# EAGLE schematic cs_v2 (EAGLE 9.6.1)

## Sheet 1 of 3
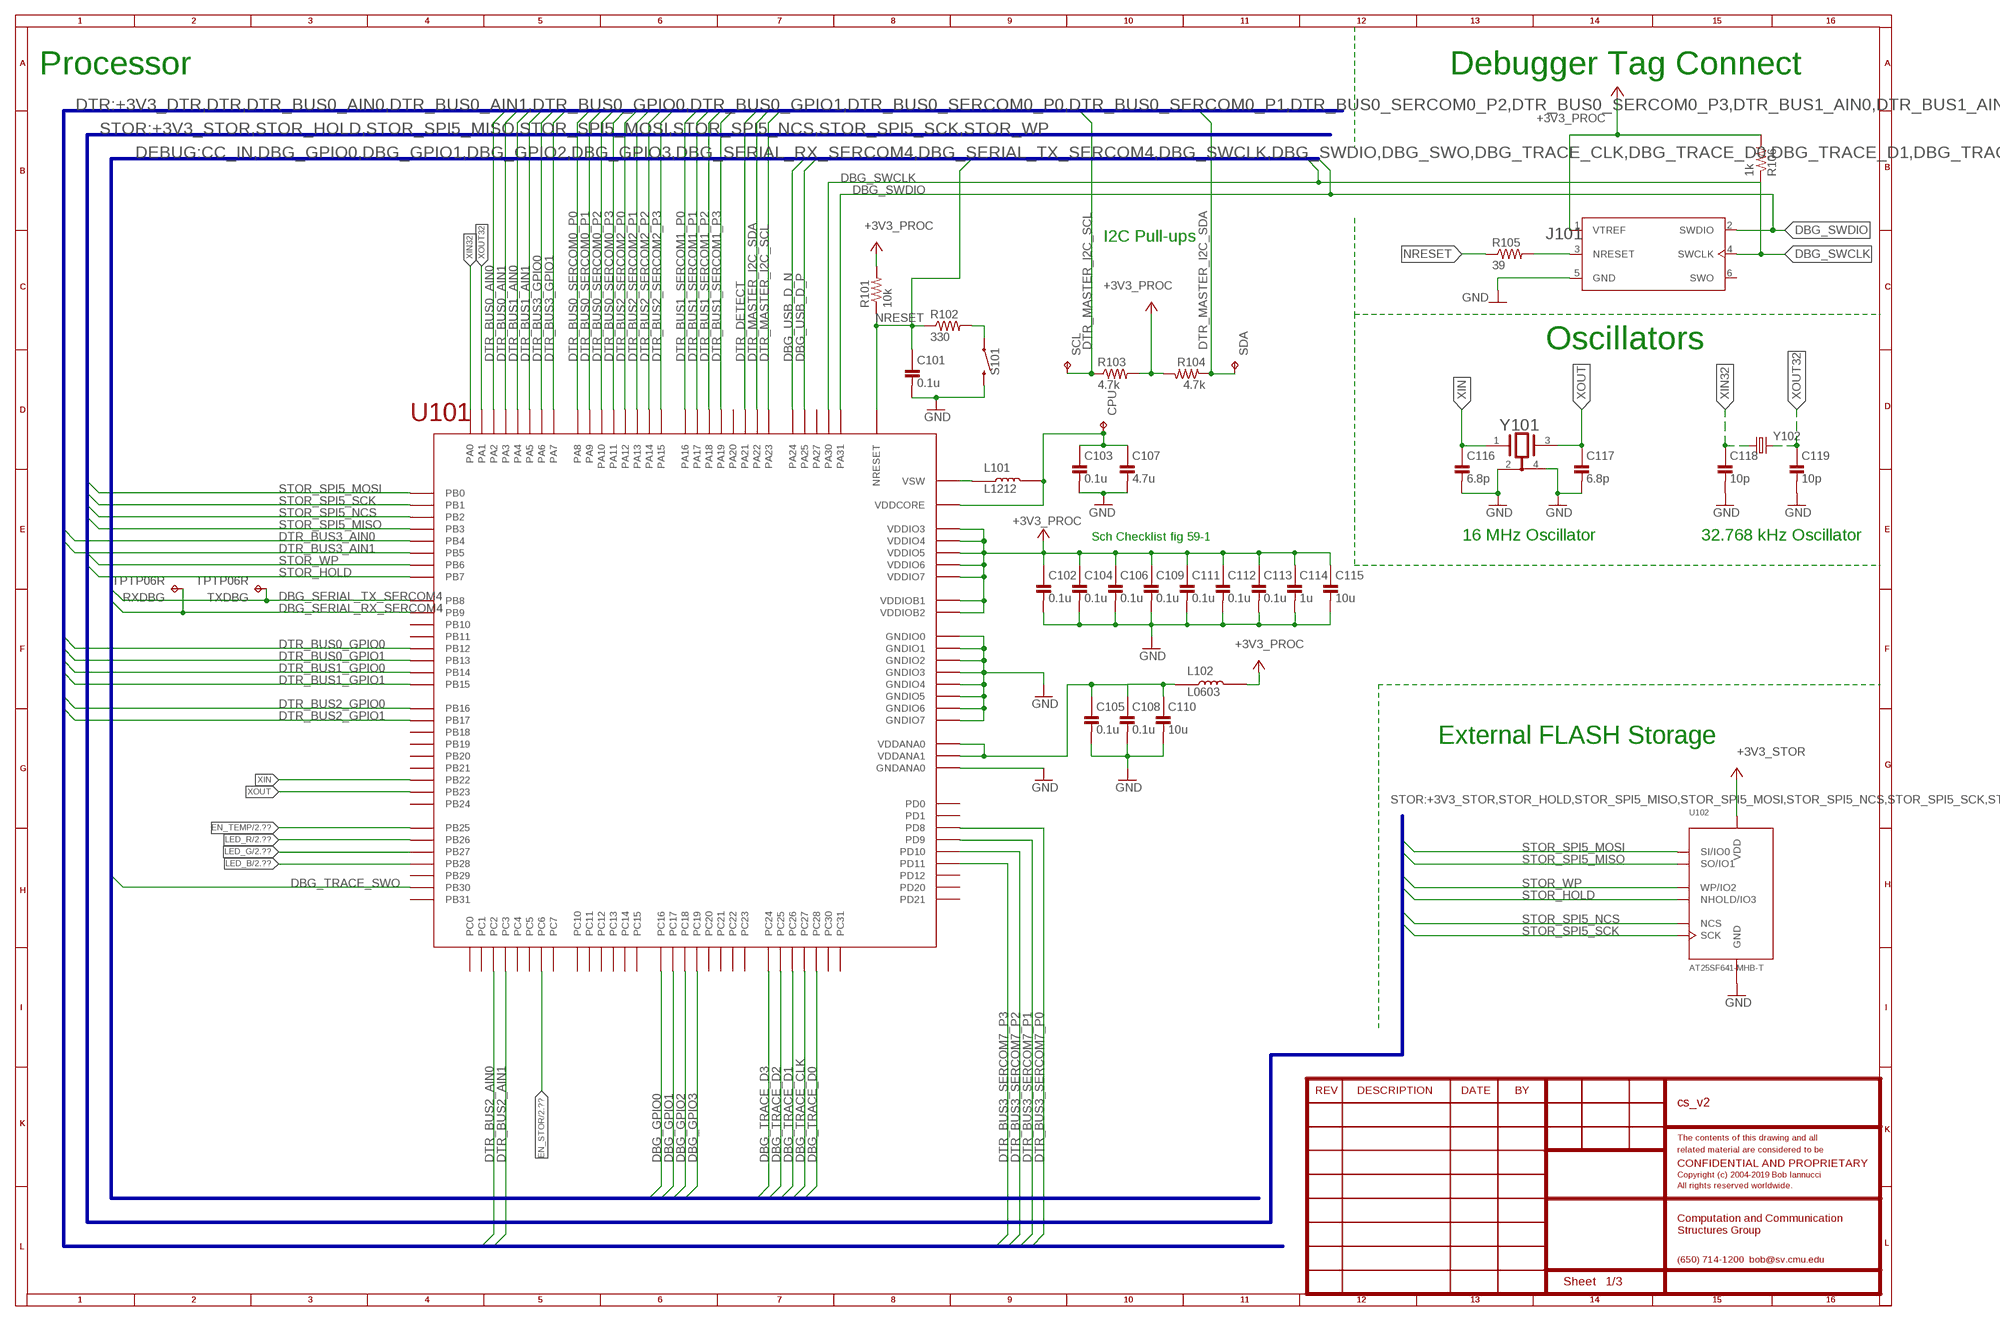
[diagram p0: schematic, sheet 1, part 1 of 2]
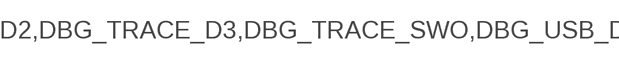
[diagram p1: schematic, sheet 1, part 2 of 2]

### Parts
C101  0.1u  C-0402  [C0402]
C102  0.1u  C-0402  [C0402]
C103  0.1u  C-0402  [C0402]
C104  0.1u  C-0402  [C0402]
C105  0.1u  C-0402  [C0402]
C106  0.1u  C-0402  [C0402]
C107  4.7u  C-0805  [C0805]
C108  0.1u  C-0402  [C0402]
C109  0.1u  C-0402  [C0402]
C110  10u  C-0805  [C0805]
C111  0.1u  C-0402  [C0402]
C112  0.1u  C-0402  [C0402]
C113  0.1u  C-0402  [C0402]
C114  1u  C-0402  [C0402]
C115  10u  C-0805  [C0805]
C116  6.8p  C-0402  [C0402]
C117  6.8p  C-0402  [C0402]
C118  10p  C-0402  [C0402]
C119  10p  C-0402  [C0402]
CPU  TPTP06R  [TP06R]
J101  J-JTAG-CORTEX-NEEDLE6-LEGS  [8.06.16_6-PIN_NEEDLE_ADAPTER_LEGS]
L101  L1212  [L1212]
L102  L0603  [L0603]
R101  10k  R-0402  [R0402]
R102  330  R-0402  [R0402]
R103  4.7k  R-0402  [R0402]
R104  4.7k  R-0402  [R0402]
R105  39  R-0402  [R0402]
R106  1k  R-0402  [R0402]
RXDBG  TPTP06R  [TP06R]
S101  SW_EVQ-P7L01P_SPST_RA  [SW_EVQ-P7L01P]
SCL  TPTP06R  [TP06R]
SDA  TPTP06R  [TP06R]
TXDBG  TPTP06R  [TP06R]
U101  ATSAMD51  [TFBGA120]
U102  AT25SF641-MHB-T  [8-UDFN]
Y101  16M  EPSON_TSX-3225_16.0000MF09Z-AC3  [XTAL_EPSON_TSX3225]
Y102  ABS07-32.768KHZ-9-T  [XTAL320X150X90]

### Nets
+3V3_PROC: C102.1 C104.1 C106.1 C109.1 C111.1 C112.1 C113.1 C114.1 C115.1 J101.1(VTREF) L102.2 R101.2 R103.2 R104.2 R106.2 U101.VDDIO3 U101.VDDIO4 U101.VDDIO5 U101.VDDIO6 U101.VDDIO7 U101.VDDIOB1 U101.VDDIOB2 ; supply symbol labelled +3V3 ; also sheet 2,3
+3V3_STOR [power_3v3]: U102.8(VDD) ; supply symbol labelled +3V3 ; also sheet 2
DBG_GPIO0: U101.PC16 ; also sheet 3
DBG_GPIO1: U101.PC17 ; also sheet 3
DBG_GPIO2: U101.PC18 ; also sheet 3
DBG_GPIO3: U101.PC19 ; also sheet 3
DBG_SERIAL_RX_SERCOM4: RXDBG.TP U101.PB09(PB9) ; also sheet 3
DBG_SERIAL_TX_SERCOM4: TXDBG.TP U101.PB08(PB8) ; also sheet 3
DBG_SWCLK: J101.4(SWCLK) R106.1 U101.PA30 ; also sheet 3
DBG_SWDIO: J101.2(SWDIO) U101.PA31 ; also sheet 3
DBG_TRACE_CLK: U101.PC27 ; also sheet 3
DBG_TRACE_D0: U101.PC28 ; also sheet 3
DBG_TRACE_D1: U101.PC26 ; also sheet 3
DBG_TRACE_D2: U101.PC25 ; also sheet 3
DBG_TRACE_D3: U101.PC24 ; also sheet 3
DBG_TRACE_SWO: U101.PB30 ; also sheet 3
DBG_USB_D_N [differential]: U101.PA24 ; also sheet 3
DBG_USB_D_P [differential]: U101.PA25 ; also sheet 3
DTR_BUS0_AIN0: U101.PA02(PA2) ; also sheet 3
DTR_BUS0_AIN1: U101.PA03(PA3) ; also sheet 3
DTR_BUS0_GPIO0: U101.PB12 ; also sheet 3
DTR_BUS0_GPIO1: U101.PB13 ; also sheet 3
DTR_BUS0_SERCOM0_P0: U101.PA08(PA8) ; also sheet 3
DTR_BUS0_SERCOM0_P1: U101.PA09(PA9) ; also sheet 3
DTR_BUS0_SERCOM0_P2: U101.PA10 ; also sheet 3
DTR_BUS0_SERCOM0_P3: U101.PA11 ; also sheet 3
DTR_BUS1_AIN0: U101.PA04(PA4) ; also sheet 3
DTR_BUS1_AIN1: U101.PA05(PA5) ; also sheet 3
DTR_BUS1_GPIO0: U101.PB14 ; also sheet 3
DTR_BUS1_GPIO1: U101.PB15 ; also sheet 3
DTR_BUS1_SERCOM1_P0: U101.PA16 ; also sheet 3
DTR_BUS1_SERCOM1_P1: U101.PA17 ; also sheet 3
DTR_BUS1_SERCOM1_P2: U101.PA18 ; also sheet 3
DTR_BUS1_SERCOM1_P3: U101.PA19 ; also sheet 3
DTR_BUS2_AIN0: U101.PC02(PC2) ; also sheet 3
DTR_BUS2_AIN1: U101.PC03(PC3) ; also sheet 3
DTR_BUS2_GPIO0: U101.PB16 ; also sheet 3
DTR_BUS2_GPIO1: U101.PB17 ; also sheet 3
DTR_BUS2_SERCOM2_P0: U101.PA12 ; also sheet 3
DTR_BUS2_SERCOM2_P1: U101.PA13 ; also sheet 3
DTR_BUS2_SERCOM2_P2: U101.PA14 ; also sheet 3
DTR_BUS2_SERCOM2_P3: U101.PA15 ; also sheet 3
DTR_BUS3_AIN0: U101.PB04(PB4) ; also sheet 3
DTR_BUS3_AIN1: U101.PB05(PB5) ; also sheet 3
DTR_BUS3_GPIO0: U101.PA06(PA6) ; also sheet 3
DTR_BUS3_GPIO1: U101.PA07(PA7) ; also sheet 3
DTR_BUS3_SERCOM7_P0: U101.PD08(PD8) ; also sheet 3
DTR_BUS3_SERCOM7_P1: U101.PD09(PD9) ; also sheet 3
DTR_BUS3_SERCOM7_P2: U101.PD10 ; also sheet 3
DTR_BUS3_SERCOM7_P3: U101.PD11 ; also sheet 3
DTR_DETECT: U101.PA21 ; also sheet 3
DTR_MASTER_I2C_SCL: R103.1 SCL.TP U101.PA23 ; also sheet 2,3
DTR_MASTER_I2C_SDA: R104.1 SDA.TP U101.PA22 ; also sheet 2,3
EN_STOR: U101.PC06(PC6) ; also sheet 2
EN_TEMP: U101.PB25 ; also sheet 2
GND: C101.2 C102.2 C103.2 C104.2 C105.2 C106.2 C107.2 C108.2 C109.2 C110.2 C111.2 C112.2 C113.2 C114.2 C115.2 C116.2 C117.2 C118.2 C119.2 J101.5(GND) S101.2_1 S101.2_2 U101.GNDANA0 U101.GNDIO0 U101.GNDIO1 U101.GNDIO2 U101.GNDIO3 U101.GNDIO4 U101.GNDIO5 U101.GNDIO6 U101.GNDIO7 U102.4(GND) U102.9(GND) Y101.2(1_GND) Y101.4(2_GND) ; also sheet 2,3
JTAG_NRESET: J101.3(NRESET) R105.2
LED_B: U101.PB28 ; also sheet 2
LED_G: U101.PB27 ; also sheet 2
LED_R: U101.PB26 ; also sheet 2
N$5: R102.2 S101.1_1 S101.1_2
NRESET: C101.1 R101.1 R102.1 R105.1 U101.NRESET ; also sheet 3
STOR_HOLD: U101.PB07(PB7) U102.7(NHOLD/IO3)
STOR_SPI5_MISO: U101.PB03(PB3) U102.2(SO/IO1)
STOR_SPI5_MOSI: U101.PB00(PB0) U102.5(SI/IO0)
STOR_SPI5_NCS: U101.PB02(PB2) U102.1(NCS)
STOR_SPI5_SCK: U101.PB01(PB1) U102.6(SCK)
STOR_WP: U101.PB06(PB6) U102.3(WP/IO2)
VDDANA: C105.1 C108.1 C110.1 L102.1 U101.VDDANA0 U101.VDDANA1
VDDCORE: C103.1 C107.1 CPU.TP L101.P$2 U101.VDDCORE
VSW: L101.P$1 U101.VSW
XIN: C116.1 U101.PB22 Y101.1
XIN32: C118.1 U101.PA00(PA0) Y102.1
XOUT: C117.1 U101.PB23 Y101.3
XOUT32: C119.1 U101.PA01(PA1) Y102.2
Unconnected: J101.6(SWO) U101.PA20 U101.PA27 U101.PB10 U101.PB11 U101.PB18 U101.PB19 U101.PB20 U101.PB21 U101.PB24 U101.PB29 U101.PB31 U101.PC00(PC0) U101.PC01(PC1) U101.PC04(PC4) U101.PC05(PC5) U101.PC07(PC7) U101.PC10 U101.PC11 U101.PC12 U101.PC13 U101.PC14 U101.PC15 U101.PC20 U101.PC21 U101.PC22 U101.PC23 U101.PC30 U101.PC31 U101.PD00(PD0) U101.PD01(PD1) U101.PD12 U101.PD20 U101.PD21

### Buses
STOR:+3V3_STOR,STOR_HOLD,STOR_SPI5_MISO,STOR_SPI5_MOSI,STOR_SPI5_NCS,STOR_SPI5_SCK,STOR_WP
DTR:+3V3_DTR,DTR,DTR_BUS0_AIN0,DTR_BUS0_AIN1,DTR_BUS0_GPIO0,DTR_BUS0_GPIO1,DTR_BUS0_SERCOM0_P0,DTR_BUS0_SERCOM0_P1,DTR_BUS0_SERCOM0_P2,DTR_BUS0_SERCOM0_P3,DTR_BUS1_AIN0,DTR_BUS1_AIN1,DTR_BUS1_GPIO0,DTR_BUS1_GPIO1,DTR_BUS1_SERCOM1_P0,DTR_BUS1_SERCOM1_P1,DTR_BUS1_SERCOM1_P2,DTR_BUS1_SERCOM1_P3,DTR_BUS2_AIN0,DTR_BUS2_AIN1,DTR_BUS2_GPIO0,DTR_BUS2_GPIO1,DTR_BUS2_SERCOM2_P0,DTR_BUS2_SERCOM2_P1,DTR_BUS2_SERCOM2_P2,DTR_BUS2_SERCOM2_P3,DTR_BUS3_AIN0,DTR_BUS3_AIN1,DTR_BUS3_GPIO0,DTR_BUS3_GPIO1,DTR_BUS3_SERCOM7_P0,DTR_BUS3_SERCOM7_P1,DTR_BUS3_SERCOM7_P2,DTR_BUS3_SERCOM7_P3,DTR_DETECT,DTR_MASTER_I2C_SCL,DTR_MASTER_I2C_SDA
DEBUG:CC_IN,DBG_GPIO0,DBG_GPIO1,DBG_GPIO2,DBG_GPIO3,DBG_SERIAL_RX_SERCOM4,DBG_SERIAL_TX_SERCOM4,DBG_SWCLK,DBG_SWDIO,DBG_SWO,DBG_TRACE_CLK,DBG_TRACE_D0,DBG_TRACE_D1,DBG_TRACE_D2,DBG_TRACE_D3,DBG_TRACE_SWO,DBG_USB_D-,DBG_USB_D+,NRESET,VDD_DBG

### Notes on the sheet
- Processor | Debugger Tag Connect
- I2C Pull-ups
- Oscillators
- Sch Checklist fig 59-1 | 16 MHz Oscillator | 32.768 kHz Oscillator
- External FLASH Storage

## Sheet 2 of 3
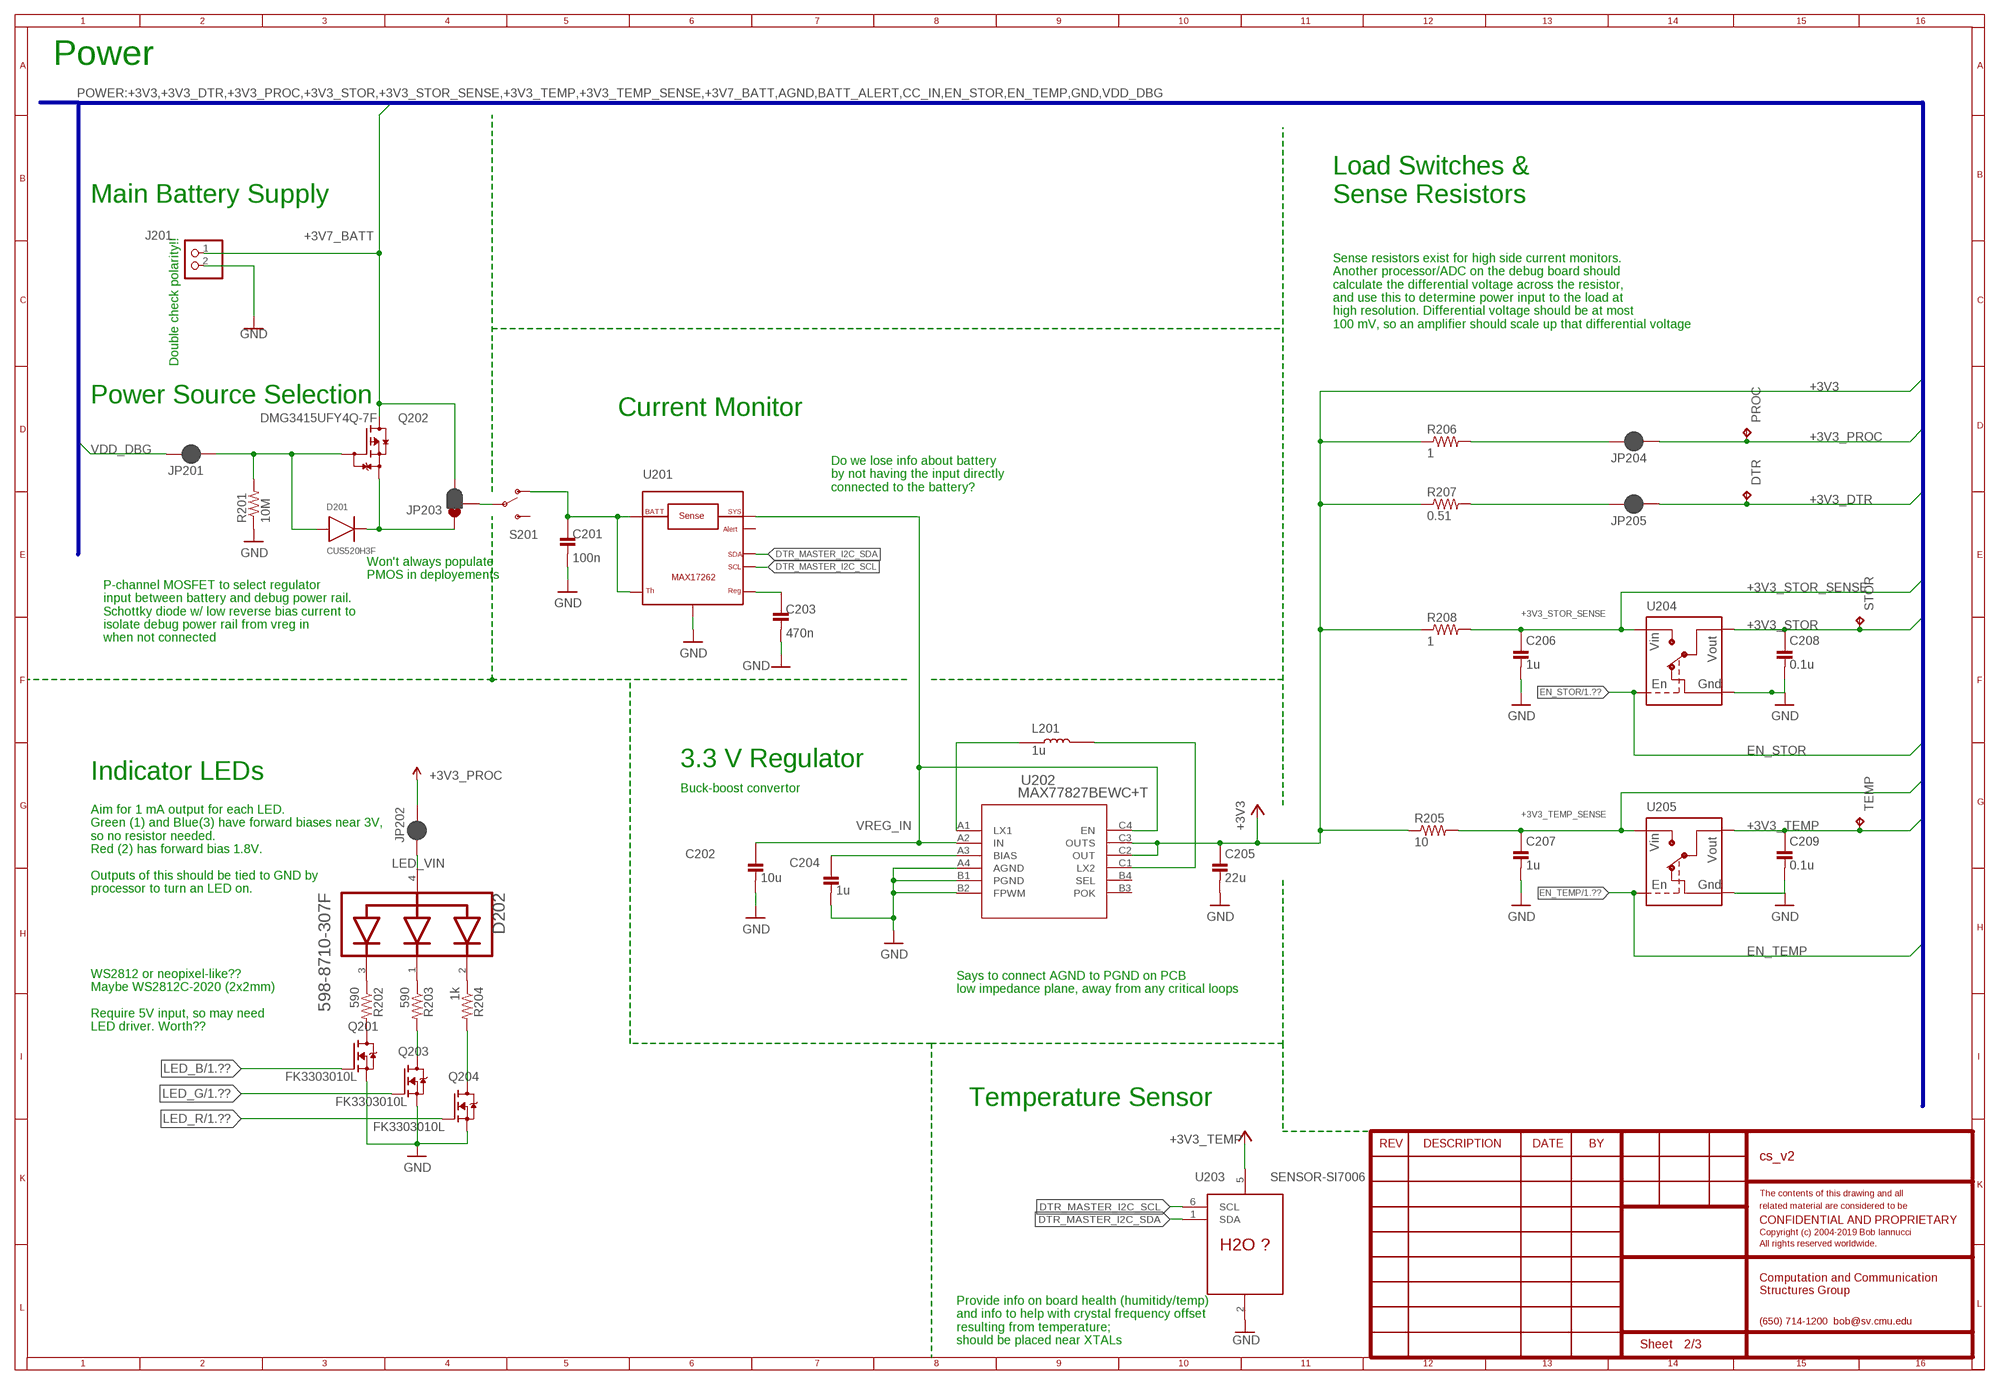
[diagram p2: schematic, sheet 2]

### Parts
C201  100n  C-0402  [C0402]
C202  10u  C-0603  [C0603]
C203  470n  C-0402  [C0402]
C204  1u  C-0402  [C0402]
C205  22u  C-0805  [C0805]
C206  1u  C-0402  [C0402]
C207  1u  C-0402  [C0402]
C208  0.1u  C-0402  [C0402]
C209  0.1u  C-0402  [C0402]
D201  CUS520H3F  [CUS520H3F]
D202  DIALIGHT_RGBLED_598-8710-307FDIALIGHT_598-8710-307F_0_0  [DIALIGHT_0606_598-8710-307F_0]
DTR  TPTP06R  [TP06R]
J201  J-JST2-SMT-RA  [JST-PH-2-SMT-RA]
JP201  JUMPER-SMT_2_NC_PASTE_NO-SILK  [SMT-JUMPER_2_NC_PASTE_NO-SILK]
JP202  JUMPER-SMT_2_NC_PASTE_NO-SILK  [SMT-JUMPER_2_NC_PASTE_NO-SILK]
JP203  JUMPER-SMT_3_1-NC_PASTE_NO-SILK  [SMT-JUMPER_3_1-NC_PASTE_NO-SILK]
JP204  JUMPER-SMT_2_NC_PASTE_NO-SILK  [SMT-JUMPER_2_NC_PASTE_NO-SILK]
JP205  JUMPER-SMT_2_NC_PASTE_NO-SILK  [SMT-JUMPER_2_NC_PASTE_NO-SILK]
L201  1u  L1008  [L1008]
PROC  TPTP06R  [TP06R]
Q201  FK3303010L  [SSSMINI3]
Q202  DMG3415UFY4Q-7F  [X2-DFN2015-3]
Q203  FK3303010L  [SSSMINI3]
Q204  FK3303010L  [SSSMINI3]
R201  10M  R-0402  [R0402]
R202  590  R-0402  [R0402]
R203  590  R-0402  [R0402]
R204  1k  R-0402  [R0402]
R205  10  R-0603  [R0603]
R206  1  R-0603  [R0603]
R207  0.51  R-0603  [R0603]
R208  1  R-0603  [R0603]
S201  SLIDESWITCH-SPDT-SMD-RIGHT-ANGLE  [SWITCH_SPST_SMD_A]
STOR  TPTP06R  [TP06R]
TEMP  TPTP06R  [TP06R]
U201  COULOMB-MAX17262  [BGA9N40P3X3_144X146X69N]
U202  MAX77827BEWC+T  [12-WLP]
U203  SENSOR-SI7006  [DFN-06]
U204  LOADSWITCH-MIC94164  [WLCSP6_2X3]
U205  LOADSWITCH-MIC94164  [WLCSP6_2X3]

### Nets
+3V3 [power_3v3]: C205.1 R205.1 R206.1 R207.1 R208.1 U202.C2(OUT) U202.C3(OUTS) ; also sheet 3
+3V3_DTR [power_3v3]: DTR.TP JP205.1 ; also sheet 3
+3V3_DTR_SENSE: JP205.2 R207.2
+3V3_PROC: JP202.2 JP204.1 PROC.TP ; supply symbol labelled VIN ; also sheet 1,3
+3V3_PROC_SENSE: JP204.2 R206.2
+3V3_STOR [power_3v3]: C208.1 STOR.TP U204.A1(VOUT) U204.B1(VOUT) ; also sheet 1
+3V3_STOR_SENSE: C206.1 R208.2 U204.A2(VIN) U204.B2(VIN) ; also sheet 3
+3V3_TEMP: C209.1 TEMP.TP U203.5(V) U205.A1(VOUT) U205.B1(VOUT) ; supply symbol labelled +3V3
+3V3_TEMP_SENSE: C207.1 R205.2 U205.A2(VIN) U205.B2(VIN) ; also sheet 3
+3V7_BATT [power_3v3]: J201.1 JP203.3 Q202.3-1(D) Q202.3-2(D) ; also sheet 3
CC_IN [power_3v3]: C201.1 S201.1(O) U201.A1(TH) U201.A2(BATT)
DTR_MASTER_I2C_SCL: U201.B1(SCL) U203.6(SCL) ; also sheet 1,3
DTR_MASTER_I2C_SDA: U201.C1(SDA) U203.1(SDA) ; also sheet 1,3
EN_STOR: U204.C2(ENABLE) ; also sheet 1
EN_TEMP: U205.C2(ENABLE) ; also sheet 1
GND: C201.2 C202.2 C203.2 C204.2 C205.2 C206.2 C207.2 C208.2 C209.2 J201.2 Q201.1(S) Q203.1(S) Q204.1(S) R201.1 U201.C3(GND) U202.A4(AGND) U202.B1(PGND) U202.B2(FPWM) U203.2(GND) U204.C1(GND) U205.C1(GND) ; also sheet 1,3
LED_B: Q201.3(G) ; also sheet 1
LED_G: Q203.3(G) ; also sheet 1
LED_R: Q204.3(G) ; also sheet 1
LED_VIN: D202.4(COMMON_ANODE) JP202.1
N$4: D202.3(BLUE_CATHODE) R202.1
N$12: D202.1(GREEN_CATHODE) R203.1
N$13: C203.1 U201.C2(REG)
N$14: D202.2(RED_CATHODE) R204.1
N$15: Q201.2(D) R202.2
N$16: Q203.2(D) R203.2
N$17: Q204.2(D) R204.2
VDD_DBG [power_3v3]: JP201.2 ; also sheet 3
VDD_DBG_JMP [power_3v3]: D201.P JP201.1 Q202.1(G) R201.2
VDD_SW [power_3v3]: D201.N JP203.1 Q202.2(S)
VDD_SW_IN [power_3v3]: JP203.2 S201.2(P)
VREG_BIAS: C204.1 U202.A3(BIAS)
VREG_IN [power_3v3]: C202.1 U201.B3(SYS) U202.A2(IN) U202.C4(EN)
VREG_LX1: L201.1 U202.A1(LX1)
VREG_LX2: L201.2 U202.C1(LX2)
Unconnected: S201.3(S) U201.B2(ALRT) U202.B3(POK) U202.B4(SEL)

### Buses
POWER:+3V3,+3V3_DTR,+3V3_PROC,+3V3_STOR,+3V3_STOR_SENSE,+3V3_TEMP,+3V3_TEMP_SENSE,+3V7_BATT,AGND,BATT_ALERT,CC_IN,EN_STOR,EN_TEMP,GND,VDD_DBG

### Notes on the sheet
- Power
- Main Battery Supply
- Load Switches &
  Sense Resistors
- Sense resistors exist for high side current monitors.
  Another processor/ADC on the debug board should
  calculate the differential voltage across the resistor, 
  and use this to determine power input to the load at
  high resolution. Differential voltage should be at most 
  100 mV, so an amplifier should scale up that differential voltage
- Double check polarity!!
- Power Source Selection
- Current Monitor
- Do we lose info about battery
  by not having the input directly
  connected to the battery?
- Won't always populate 
  PMOS in deployements
- P-channel MOSFET to select regulator
  input between battery and debug power rail.
  Schottky diode w/ low reverse bias current to
  isolate debug power rail from vreg in
  when not connected
- 3.3 V Regulator
- Indicator LEDs
- Buck-boost convertor
- Aim for 1 mA output for each LED.
  Green (1) and Blue(3) have forward biases near 3V, 
  so no resistor needed.
  Red (2) has forward bias 1.8V.
  
  Outputs of this should be tied to GND by 
  processor to turn an LED on.
- Says to connect AGND to PGND on PCB
  low impedance plane, away from any critical loops
- WS2812 or neopixel-like??
  Maybe WS2812C-2020 (2x2mm)
  
  Require 5V input, so may need 
  LED driver. Worth??
- Temperature Sensor
- Provide info on board health (humitidy/temp) 
  and info to help with crystal frequency offset
  resulting from temperature; 
  should be placed near XTALs

## Sheet 3 of 3
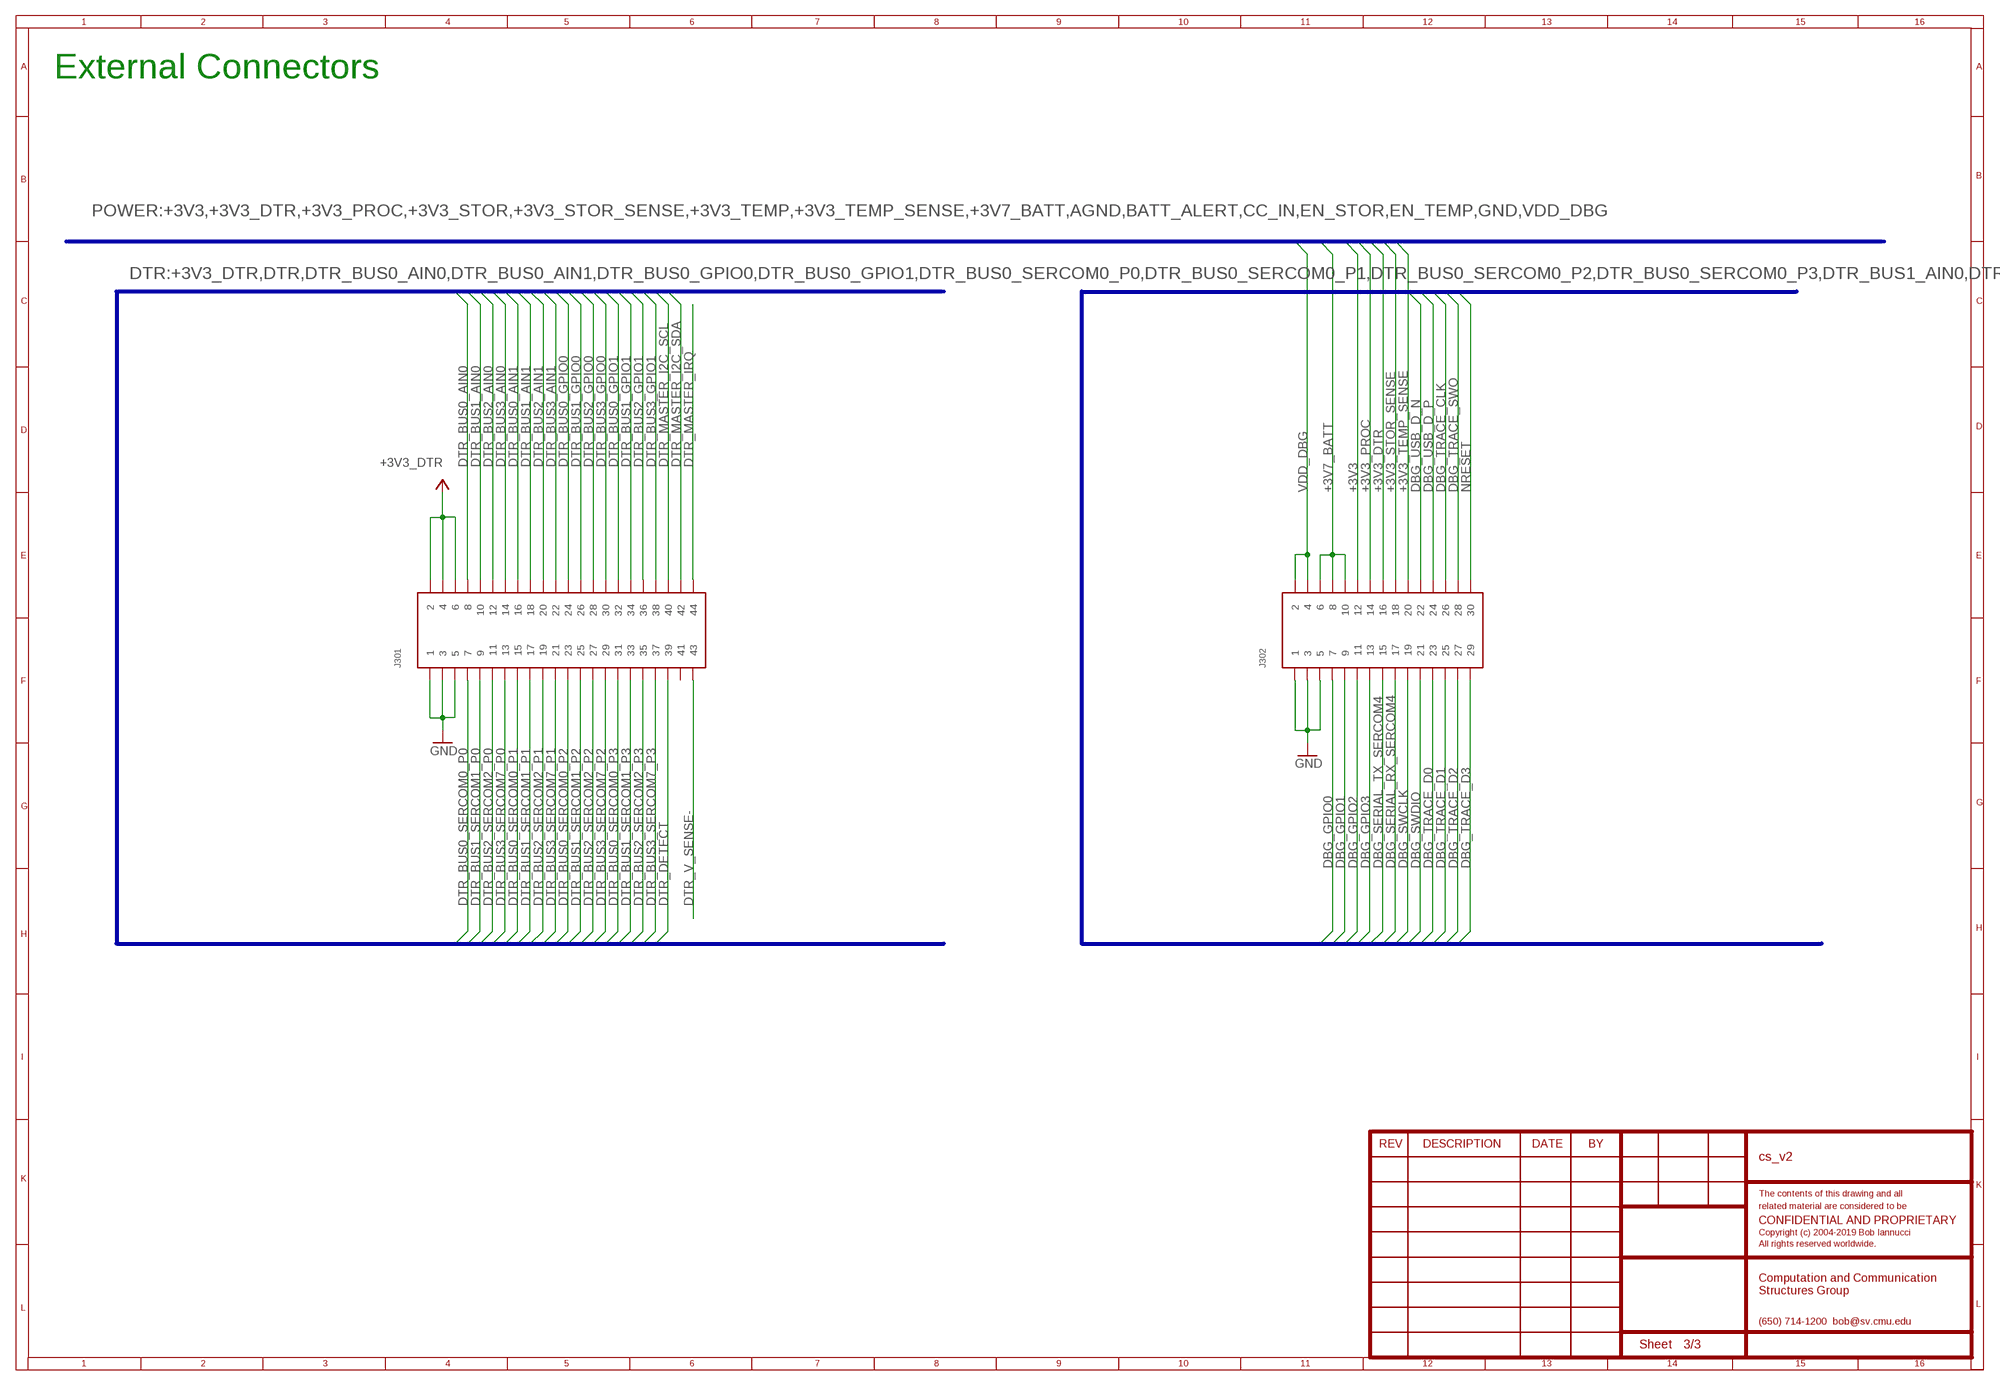
[diagram p3: schematic, sheet 3]

### Parts
J301  HIROSE-DF40_44-PIN_CONNECTORS-RECEPTACLE  [HRS_DF40HC(3.0)-44DS-0.4V(51)]
J302  HIROSE-DF40_30-PIN_CONNECTORS-RECEPTACLE  [HRS_DF40HC(3.0)-30DS-0.4V(51)]

### Nets
+3V3 [power_3v3]: J302.12 ; also sheet 2
+3V3_DTR [power_3v3]: J301.2 J301.4 J301.6 J302.16 ; supply symbol labelled +3V3 ; also sheet 2
+3V3_PROC: J302.14 ; also sheet 1,2
+3V3_STOR_SENSE: J302.18 ; also sheet 2
+3V3_TEMP_SENSE: J302.20 ; also sheet 2
+3V7_BATT [power_3v3]: J302.6 J302.8 J302.10 ; also sheet 2
DBG_GPIO0: J302.7 ; also sheet 1
DBG_GPIO1: J302.9 ; also sheet 1
DBG_GPIO2: J302.11 ; also sheet 1
DBG_GPIO3: J302.13 ; also sheet 1
DBG_SERIAL_RX_SERCOM4: J302.17 ; also sheet 1
DBG_SERIAL_TX_SERCOM4: J302.15 ; also sheet 1
DBG_SWCLK: J302.19 ; also sheet 1
DBG_SWDIO: J302.21 ; also sheet 1
DBG_TRACE_CLK: J302.26 ; also sheet 1
DBG_TRACE_D0: J302.23 ; also sheet 1
DBG_TRACE_D1: J302.25 ; also sheet 1
DBG_TRACE_D2: J302.27 ; also sheet 1
DBG_TRACE_D3: J302.29 ; also sheet 1
DBG_TRACE_SWO: J302.28 ; also sheet 1
DBG_USB_D_N [differential]: J302.22 ; also sheet 1
DBG_USB_D_P [differential]: J302.24 ; also sheet 1
DTR_BUS0_AIN0: J301.8 ; also sheet 1
DTR_BUS0_AIN1: J301.16 ; also sheet 1
DTR_BUS0_GPIO0: J301.24 ; also sheet 1
DTR_BUS0_GPIO1: J301.32 ; also sheet 1
DTR_BUS0_SERCOM0_P0: J301.7 ; also sheet 1
DTR_BUS0_SERCOM0_P1: J301.15 ; also sheet 1
DTR_BUS0_SERCOM0_P2: J301.23 ; also sheet 1
DTR_BUS0_SERCOM0_P3: J301.31 ; also sheet 1
DTR_BUS1_AIN0: J301.10 ; also sheet 1
DTR_BUS1_AIN1: J301.18 ; also sheet 1
DTR_BUS1_GPIO0: J301.26 ; also sheet 1
DTR_BUS1_GPIO1: J301.34 ; also sheet 1
DTR_BUS1_SERCOM1_P0: J301.9 ; also sheet 1
DTR_BUS1_SERCOM1_P1: J301.17 ; also sheet 1
DTR_BUS1_SERCOM1_P2: J301.25 ; also sheet 1
DTR_BUS1_SERCOM1_P3: J301.33 ; also sheet 1
DTR_BUS2_AIN0: J301.12 ; also sheet 1
DTR_BUS2_AIN1: J301.20 ; also sheet 1
DTR_BUS2_GPIO0: J301.28 ; also sheet 1
DTR_BUS2_GPIO1: J301.36 ; also sheet 1
DTR_BUS2_SERCOM2_P0: J301.11 ; also sheet 1
DTR_BUS2_SERCOM2_P1: J301.19 ; also sheet 1
DTR_BUS2_SERCOM2_P2: J301.27 ; also sheet 1
DTR_BUS2_SERCOM2_P3: J301.35 ; also sheet 1
DTR_BUS3_AIN0: J301.14 ; also sheet 1
DTR_BUS3_AIN1: J301.22 ; also sheet 1
DTR_BUS3_GPIO0: J301.30 ; also sheet 1
DTR_BUS3_GPIO1: J301.38 ; also sheet 1
DTR_BUS3_SERCOM7_P0: J301.13 ; also sheet 1
DTR_BUS3_SERCOM7_P1: J301.21 ; also sheet 1
DTR_BUS3_SERCOM7_P2: J301.29 ; also sheet 1
DTR_BUS3_SERCOM7_P3: J301.37 ; also sheet 1
DTR_DETECT: J301.39 ; also sheet 1
DTR_MASTER_I2C_SCL: J301.40 ; also sheet 1,2
DTR_MASTER_I2C_SDA: J301.42 ; also sheet 1,2
DTR_MASTER_IRQ: J301.44
DTR_V_SENSE-: J301.43
GND: J301.1 J301.3 J301.5 J302.1 J302.3 J302.5 ; also sheet 1,2
NRESET: J302.30 ; also sheet 1
VDD_DBG [power_3v3]: J302.2 J302.4 ; also sheet 2
Unconnected: J301.41

### Buses
DTR:+3V3_DTR,DTR,DTR_BUS0_AIN0,DTR_BUS0_AIN1,DTR_BUS0_GPIO0,DTR_BUS0_GPIO1,DTR_BUS0_SERCOM0_P0,DTR_BUS0_SERCOM0_P1,DTR_BUS0_SERCOM0_P2,DTR_BUS0_SERCOM0_P3,DTR_BUS1_AIN0,DTR_BUS1_AIN1,DTR_BUS1_GPIO0,DTR_BUS1_GPIO1,DTR_BUS1_SERCOM1_P0,DTR_BUS1_SERCOM1_P1,DTR_BUS1_SERCOM1_P2,DTR_BUS1_SERCOM1_P3,DTR_BUS2_AIN0,DTR_BUS2_AIN1,DTR_BUS2_GPIO0,DTR_BUS2_GPIO1,DTR_BUS2_SERCOM2_P0,DTR_BUS2_SERCOM2_P1,DTR_BUS2_SERCOM2_P2,DTR_BUS2_SERCOM2_P3,DTR_BUS3_AIN0,DTR_BUS3_AIN1,DTR_BUS3_GPIO0,DTR_BUS3_GPIO1,DTR_BUS3_SERCOM7_P0,DTR_BUS3_SERCOM7_P1,DTR_BUS3_SERCOM7_P2,DTR_BUS3_SERCOM7_P3,DTR_DETECT,DTR_MASTER_I2C_SCL,DTR_MASTER_I2C_SDA
DEBUG:CC_IN,DBG_GPIO0,DBG_GPIO1,DBG_GPIO2,DBG_GPIO3,DBG_SERIAL_RX_SERCOM4,DBG_SERIAL_TX_SERCOM4,DBG_SWCLK,DBG_SWDIO,DBG_SWO,DBG_TRACE_CLK,DBG_TRACE_D0,DBG_TRACE_D1,DBG_TRACE_D2,DBG_TRACE_D3,DBG_TRACE_SWO,DBG_USB_D-,DBG_USB_D+,NRESET,VDD_DBG
POWER:+3V3,+3V3_DTR,+3V3_PROC,+3V3_STOR,+3V3_STOR_SENSE,+3V3_TEMP,+3V3_TEMP_SENSE,+3V7_BATT,AGND,BATT_ALERT,CC_IN,EN_STOR,EN_TEMP,GND,VDD_DBG

### Notes on the sheet
- External Connectors

## Library data of the parts
C101-C106 C108 C109 C111-C113 C208 C209 = Capacitors:C-: Capacitor, Surface Mount; MANUFACTURER: Kemet; PART_NO: C0402C104K8RACTU; TC: X7R; TOL: 10%; VOLTAGE: 10V
C107 = Capacitors:C-: Capacitor, Surface Mount; MANUFACTURER: Kemet; PART_NO: C0805C475K8RACTU; TC: X7R; TOL: 10%; VOLTAGE: 10V
C110 C115 = Capacitors:C-: Capacitor, Surface Mount; MANUFACTURER: Kemet; PART_NO: C0805C106M8RACTU; TC: X7R; TOL: 10%; VOLTAGE: 10V
C114 C206 C207 = Capacitors:C-: Capacitor, Surface Mount; MANUFACTURER: Kemet; PART_NO: C0402C105M8PACTU; TC: X5R; TOL: 10%; VOLTAGE: 10V
C116 C117 = Capacitors:C-: Capacitor, Surface Mount; MANUFACTURER: Kemet; PART_NO: C0402C689D8GAC7867; TC: X7R; TOL: 10%; VOLTAGE: 6.3V
C118 C119 = Capacitors:C-: Capacitor, Surface Mount; MANUFACTURER: Kemet; PART_NO: C0402C100C8GACTU; TC: X7R; TOL: 10%; VOLTAGE: 6.3V
C201 = Capacitors:C-: Capacitor, Surface Mount; MANUFACTURER: Kemet; MP: CC0402KRX5R5BB104; PART_NO: CC0402KRX5R5BB104; TC: X7R; TOL: 10%; VOLTAGE: 6.3V
C202 = Capacitors:C-: Capacitor, Surface Mount; MANUFACTURER: Kemet; PART_NO: C0603C106M8PAC7867; TC: X5R; TOL: 10%; VOLTAGE: 10V
C203 = Capacitors:C-: Capacitor, Surface Mount; MANUFACTURER: Kemet; MP: CC0402KRX5R5BB474; PART_NO: CC0402KRX5R5BB474; TC: X7R; TOL: 10%; VOLTAGE: 6.3V
C204 = Capacitors:C-: Capacitor, Surface Mount; MANUFACTURER: Kemet; PART_NO: C0402C105K8PACTU; TC: X5R; TOL: 10%; VOLTAGE: 10V
C205 = Capacitors:C-: Capacitor, Surface Mount; MANUFACTURER: Kemet; PART_NO: C0805C226M8PAC7800; TC: X5R; TOL: 10%; VOLTAGE: 10V
CPU DTR PROC RXDBG SCL SDA STOR TEMP TXDBG = TestPoints:TP: Test pad
D201 = Diodes:CUS520H3F: Diode Schottky 30V 200mA Surface Mount USC; DESCRIPTION: Diode Schottky 30V 200mA Surface Mount USC; MF: Toshiba Semiconductor; MP: CUS520,H3F; PACKAGE: SOD-323 Toshiba; PART_NO: CUS520,H3F
D202 = Diodes:DIALIGHT_RGBLED_598-8710-307F: Micro LED; CENTROID_NOT_SPECIFIED: No; DATASHEET: https://media.digikey.com/pdf/Data%20Sheets/Dialight%20PDFs/598_Series_0606_Pkg.pdf; DIGIKEY_DESCRIPTION: DIODE LED RGB CLEAR 0606 SMD; DIGIKEY_PART_NUMBER: 350-2096-1-ND; LEAD_FREE: yes; MF: Dialight; MOUSER_PART_NUMBER: 645-598-8710-307F; MPN: 598-8710-307F; PACKAGE: LED_SMD; PART_NO: 598-8710-307F; PREFIX: D; ROHS: yes; TEMPERATURE_RANGE_HIGH: +100°C; TEMPERATURE_RANGE_LOW: -40°C
J101 = Connectors:J-JTAG-CORTEX-NEEDLE6: Adaptor, j-Link To Pcb, 6 Pin Needle Design verified by Reese
J201 = Connectors:J-JST2: JST 2-Pin Connector SMT-RA (S2B-PH-SM4) 4UConnector #17311 SMT (B2B-PH-SM4) THM-RA (S2B-PH) THM (B2B-PH) SMT-RA (SM02B-SRSS-TB) SH (1mm pitch) Connector; MANUFACTURER: JST Sales America Inc.; MPN: S2B-PH-SM4-TB(LF)(SN); PART_NO: S2B-PH-SM4-TB(LF)(SN)
J301 = Connectors:HIROSE-DF40_44-PIN_CONNECTORS: Hirose DF40 series 44-pin mezzanine type connectors at 0.4mm pitch. Specification and Variants: https://www.hirose.com/product/document?clcode=&productname=&series=DF40&documenttype=Catalog&lang=en&documentid=D31649_en; PART_NO: DF40HC(3.0)-44DS-0.4V(51)
J302 = Connectors:HIROSE-DF40_30-PIN_CONNECTORS: Hirose DF40 Series 30-pin connector. 0.4mm pitch mezzanine-type connector Part specification and variants: https://www.hirose.com/product/document?clcode=&productname=&series=DF40&documenttype=Catalog&lang=en&documentid=D31649_en; PART_NO: DF40HC(3.0)-30DS-0.4V(58)
JP201 JP202 JP204 JP205 = Connectors:JUMPER-SMT_2_NC_PASTE: Normally closed solder jumper This jumper has an aperture in the stencil to allow solder paste to bridge the split in the wire so it's normally closed (NC). Wick off the solder to open the connection. Reapply solder to reclose the connection.; BOM: EXCLUDE
JP203 = SparkFun-Jumpers:JUMPER-SMT_3_1-NC_PASTE: Normally closed solder jumper (1 of 2 connections) This jumper has an aperture in the stencil to allow solder paste to bridge one of the two connections. One connection is normally closed (NC), while the other is normally open (NO). Wick off the solder to open the connection. Reapply solder to reclose the connection. Apply solder to the other side instead to change the current path.
L101 = Inductors:L1212: Datasheet for footprint: https://search.murata.co.jp/Ceramy/image/img/P02/JELF243A-0153.pdf; PART_NO: LQH3NPN100MMEL
L102 = Inductors:L0603; PART_NO: BLM18PG471SN1D
L201 = Inductors:L1008; PART_NO: CIGT252010EH1R0MNE
Q201 Q203 Q204 = Switches:FK3303010L: N-Channel MOSFET from Panasonic. Design verified by Reese; MANUFACTURER_PART_NUMBER: FK3303010L; PART_NO: FK3303010L; VENDOR: Panasonic
Q202 = Switches:DMG3415UFY4Q-7: P-Channel MOSFET from Diodes Inc. Design verified by Reese; PART_NO: DMG3415UFY4Q-7
R101 = Resistors:R-: Resistor, Surface Mount; MANUFACTURER: Panasonic; PART_NO: ERJ-2GEJ103X; TOL: 5%
R102 = Resistors:R-: Resistor, Surface Mount; MANUFACTURER: Panasonic; PART_NO: ERJ-2GEJ331X; TOL: 5%
R103 R104 = Resistors:R-: Resistor, Surface Mount; MANUFACTURER: Panasonic; PART_NO: ERJ-2GEJ472X; TOL: 5%
R105 = Resistors:R-: Resistor, Surface Mount; MANUFACTURER: Panasonic; PART_NO: ERJ-2GEJ390X; TOL: 5%
R106 = Resistors:R-: Resistor, Surface Mount; MANUFACTURER: Panasonic; PART_NO: ERJ-2GEJ102X; TOL: 5%
R201 = Resistors:R-: Resistor, Surface Mount; MANUFACTURER: Panasonic; PART_NO: ERJ-2GEJ106X; TOL: 5%
R202 R203 = Resistors:R-: Resistor, Surface Mount; MANUFACTURER: Panasonic; PART_NO: ERJ-2RKF5900X; TOL: 1%
R204 = Resistors:R-: Resistor, Surface Mount; MANUFACTURER: Panasonic; PART_NO: ERA-2AED102X; TOL: 0.5%
R205 = Resistors:R-: Resistor, Surface Mount; MANUFACTURER: Panasonic; PART_NO: ERA-3AHD100V; TOL: 0.5%
R206 R208 = Resistors:R-: Resistor, Surface Mount; MANUFACTURER: Panasonic; PART_NO: ERJ-3RQF1R0V; TOL: 1%
R207 = Resistors:R-: Resistor, Surface Mount; MANUFACTURER: Panasonic; PART_NO: ERJ-3BQFR51V; TOL: 1%
S101 = Switches:SW_EVQ-P7L01P_SPST_RA: Switch Tactile N.O. SPST Rectangular Button Gull Wing 0.05A 12VDC 100000Cycle 1.6N SMD Embossed T/R; DESCRIPTION: Tactile Switch SPST-NO Side Actuated Surface Mount, Right Angle; MF: Panasonic; MP: EVQP7L01P; PART_NO: EVQP7L01P
S201 = Switches:SLIDESWITCH-SPDT: Single Pole, Double Throw (SPDT) Switch Single-pole, double-throw (SPDT) switch. Variant Overview SMD-AYZ0202 Surface Mount DPDT Switch <https://www.sparkfun.com/products/597> (COM-00597) Used on e.g. LilyPad Arduino USB - ATmega32U4 Board <https://www.sparkfun.com/products/12049> PTH-11.6X4.0MM SPDT Mini Power Switch <https://www.sparkfun.com/products/102> (COM-00102) Used on e.g. SparkFun Simon Says - Through-Hole Soldering Kit <https://www.sparkfun.com/products/10547> (KIT-10547) PTH-11.6X4.0MM-KIT KIT version of SPDT Mini Power Switch - Simplifies soldering by removing tStop of switch pins - only one side can be soldered. PTH-11.6X4.0MM-LOCK LOCK version of SPDT Mini Power Switch - Offset pins hold switch in place for easier soldering. SMD-RIGHT-ANGLE Surface Mount Right Angle Switch <https://www.sparkfun.com/products/10860> (COM-10860) Used on e.g. SparkFun ESP8266 Thing <https://www.sparkfun.com/products/13231>; MANUFACTURER: Nidec Copal Electronics; MPN: CUS-12TB; PART_NO: CUS-12TB
U101 = Processors:ATSAMD51: Device for the ATSAM-D51 ARM Cortex-M4F microcontroller, in the TFBGA120 package; DIGI-KEY_PART_NUMBER: ATSAMD51P20A-CTUTCT-ND; DIGI-KEY_PURCHASE_URL: https://www.digikey.com/product-detail/en/ATSAMD51P20A-CTUT/ATSAMD51P20A-CTUTCT-ND/8594973?utm_campaign=buynow&WT.z_cid=ref_octopart_dkc_buynow&utm_medium=aggregator&curr=usd&site=us&utm_source=octopart; MF: Microchip; MP: ATSAMD51P20A-CTUT; PACKAGE: 120-TFBGA; PART_NO: ATSAMD51P20A-CTUT
U102 = Storage:AT25SF641-MHB-T: 64 Mb SPI Serial Flash module from Adesto Datasheet: http://www.adestotech.com/wp-content/uploads/AT25SF641_111.pdf; PART_NO: AT25SF641-MHB-T
U201 = CoulombCounters:COULOMB-MAX17262: 5.2 uA 1-Cell Fuel Gauge with ModelGauge m5 EZ and Internal Current Sensing; MANUFACTURER: Maxim Integrated; MP: MAX17262REWL+T; MPN: MAX17262REWL+T; PART_NO: MAX17262REWL+T
U202 = Regulators:MAX77827BEWC+T: Maxim 77827 Buck-Boost regulator The MAX77827 is a high-efficiency buck-boost regulator targeted for one-cell Li-ion powered applications with the lowest typical quiescent current in the industry of 6μA. It supports input voltages of 1.8V to 5.5V and an output volt- age range of 2.3V to 5.3V. The IC provides two different switching current levels (1.8A and 3.1A) to optimize ex- ternal component sizing based on given load current re- quirements. With the 1.8A switching current-limit option, the IC can support up to 1.0A load current in buck mode and 900mA in boost mode (VIN = 3.0V, VOUT = 3.3V).; BUILT_BY: EMA_Molly; COPYRIGHT: Copyright (C) 2018 Accelerated Designs. All rights reserved; MANUFACTURER: Maxim; MANUFACTURER_PART_NUMBER: MAX77827BEWC+T; MPN: MAX77827BEWC+; PART_NO: MAX77827BEWC+T; VENDOR: Maxim Integrated Products
U203 = Sensors:SENSOR-SI7006: I2C Humidity and Temperature Sensor; MANUFACTURER: Silicon Laboratories; MPN: SI7021-A20-GM1R; PART_NO: SI7021-A20-GM1R
U204 U205 = Switches:LOADSWITCH-MIC9416: Micrel 3A High-side Load Switch with Reverse Blocking http://ww1.microchip.com/downloads/en/DeviceDoc/MIC9416x.pdf https://www.digikey.com/product-detail/en/microchip-technology/MIC94162YCS-TR/576-4508-1-ND/4732487; MANUFACTURER: Microchip Technology; MPN: MIC94164YCS-TR; PART_NO: MIC94164YCS-TR; PART_NUMBER: MIC94164; QUENCH: YES; SOFTSTART: YES
Y101 = Oscillators:EPSON_TSX-3225_16.0000MF09Z-AC3; BUILT_BY: EMA_Matt; COPYRIGHT: Copyright (C) 2018 Accelerated Designs. All rights reserved; MANUFACTURER_PART_NUMBER: TSX-3225 16.0000MF09Z-AC3; PART_NO: TSX-3225 16.0000MF09Z-AC3; VENDOR: Epson
Y102 = Oscillators:ABS07-32.768KHZ-9-T: ABS07 Series 32.768 kHz ±20 ppm 9 pF -40 to +85 C SMT Low Profile Crystal; DESCRIPTION: 32.768kHz ±20ppm Crystal 9pF 70 kOhms 2-SMD, No Lead; MF: Abracon; MP: ABS07-32.768KHZ-9-T; PACKAGE: SMD-2 Abracon; PART_NO: ABS07-32.768KHZ-9-T

## Net classes
1 power_3v3: width 0.254 mm
5 10_mil: width 0.254 mm